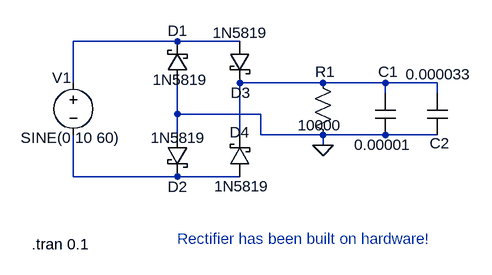
[diagram p0: schematic Rec.asc]
Rec.asc, the LTspice schematic file:
Version 4
SHEET 1 880 680
WIRE 64 128 -96 128
WIRE 160 128 64 128
WIRE -96 192 -96 128
WIRE 288 192 160 192
WIRE 384 192 288 192
WIRE 464 192 384 192
WIRE 384 208 384 192
WIRE 464 208 464 192
WIRE 64 240 64 192
WIRE 192 240 64 240
WIRE 64 272 64 240
WIRE 160 272 160 192
WIRE 192 272 192 240
WIRE 288 272 192 272
WIRE 384 272 288 272
WIRE 464 272 384 272
WIRE 288 288 288 272
WIRE -96 336 -96 272
WIRE 64 336 -96 336
WIRE 160 336 64 336
FLAG 288 288 0
SYMBOL schottky 80 192 R180
WINDOW 0 0 80 Left 2
WINDOW 3 -31 5 Left 2
SYMATTR InstName D1
SYMATTR Value 1N5819
SYMATTR Description Diode
SYMATTR Type diode
SYMBOL schottky 48 272 R0
WINDOW 0 1 80 Left 2
WINDOW 3 -25 4 Left 2
SYMATTR InstName D2
SYMATTR Value 1N5819
SYMATTR Description Diode
SYMATTR Type diode
SYMBOL schottky 144 128 R0
WINDOW 0 2 79 Left 2
WINDOW 3 -26 -13 Left 2
SYMATTR InstName D3
SYMATTR Value 1N5819
SYMATTR Description Diode
SYMATTR Type diode
SYMBOL schottky 176 336 R180
WINDOW 0 1 68 Left 2
WINDOW 3 -29 -15 Left 2
SYMATTR InstName D4
SYMATTR Value 1N5819
SYMATTR Description Diode
SYMATTR Type diode
SYMBOL res 272 176 R0
WINDOW 0 4 -1 Left 2
WINDOW 3 -23 81 Left 2
SYMATTR InstName R1
SYMATTR Value 10000
SYMBOL cap 368 208 R0
WINDOW 0 5 -33 Left 2
WINDOW 3 -32 79 Left 2
SYMATTR InstName C1
SYMATTR Value 0.00001
SYMBOL cap 448 208 R0
WINDOW 0 4 77 Left 2
WINDOW 3 -33 -29 Left 2
SYMATTR InstName C2
SYMATTR Value 0.000033
SYMBOL voltage -96 176 R0
WINDOW 0 -33 8 Left 2
WINDOW 3 -81 100 Left 2
WINDOW 123 24 124 Left 2
WINDOW 39 0 0 Left 0
SYMATTR InstName V1
SYMATTR Value SINE(0 10 60)
TEXT -160 440 Left 2 !.tran 0.1
TEXT 64 432 Left 2 ;Rectifier has been built on hardware!

The netlist it stands for:
* Rec.asc
D1 0 N001 1N5819
D2 0 N003 1N5819
D3 N001 N002 1N5819
D4 N003 N002 1N5819
R1 N002 0 10000
C1 N002 0 0.00001
C2 N002 0 0.000033
V1 N001 N003 SINE(0 10 60)
.model D D
.lib standard.dio
.tran 0.1
* Rectifier has been built on hardware!
.backanno
.end